# Altium schematic sheet IMU_Motor.SchDoc
size A; SheetNumber: 2; SheetTotal: 3
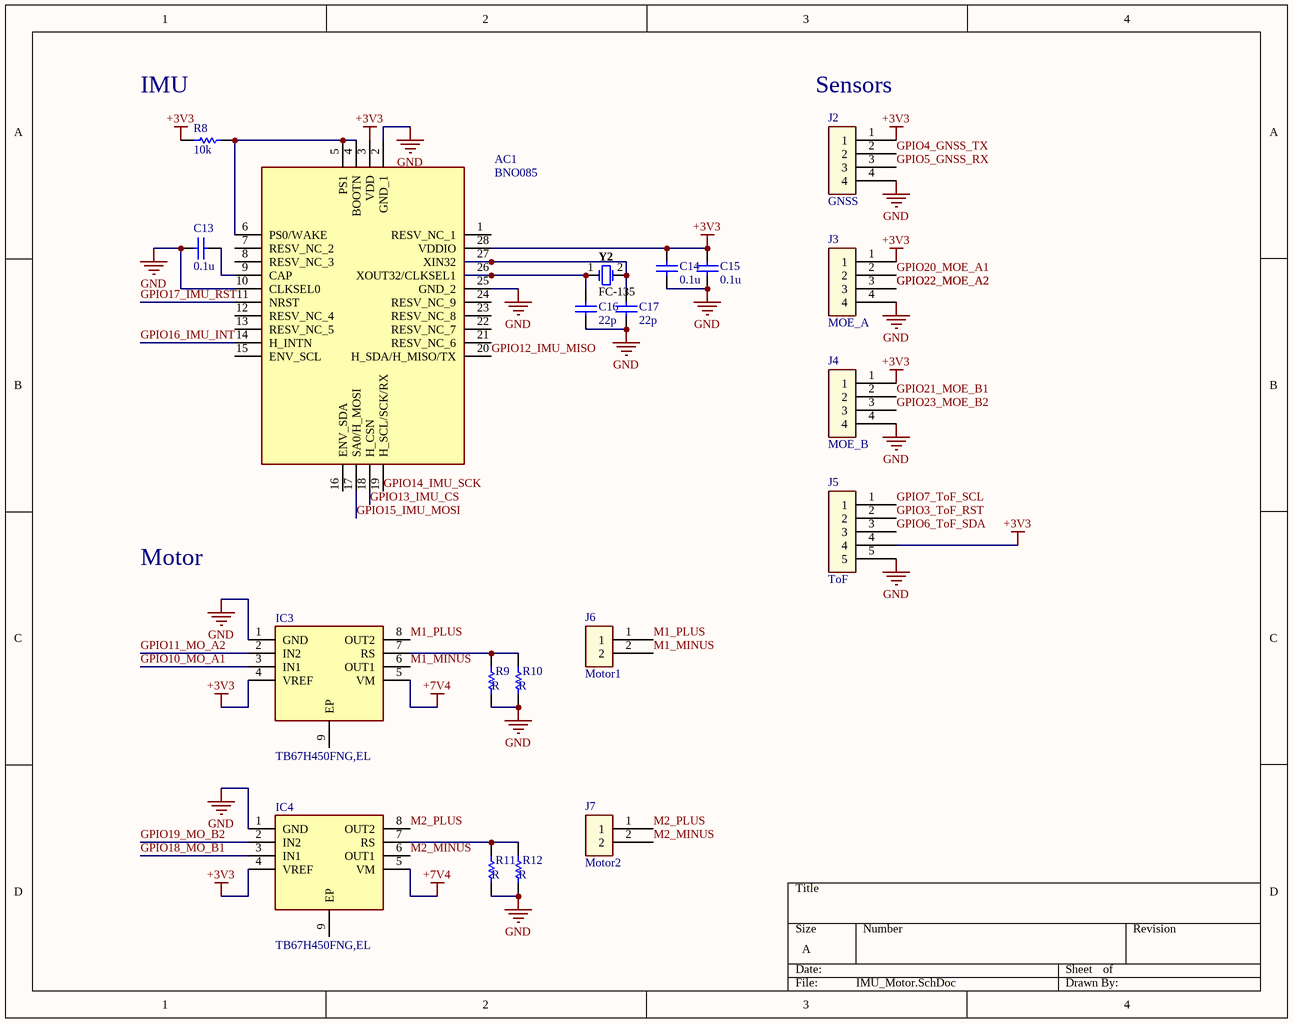
[diagram p0: IMU_Motor.SchDoc]

## Parts
AC1  BNO085  [BNO085]
C13  value 0.1u  [1608[0603]]  (hidden comment: Capacitor)
C14  value 0.1u  [1608[0603]]  (hidden comment: Capacitor)
C15  value 0.1u  [1608[0603]]  (hidden comment: Capacitor)
C16  value 22p  [1608[0603]]  (hidden comment: Capacitor)
C17  value 22p  [1608[0603]]  (hidden comment: Capacitor)
IC3  TB67H450FNG,EL  [SOIC127P600X175-9N]
IC4  TB67H450FNG,EL  [SOIC127P600X175-9N]
J2  GNSS  [PinHeader_2.0_4_SMD]
J3  MOE_A  [PinHeader_2.0_4_SMD]
J4  MOE_B  [PinHeader_2.0_4_SMD]
J5  ToF  [PinHeader_2.0_5_SMD]
J6  Motor1  [PinHeader_2.0_2_SMD]
J7  Motor2  [PinHeader_2.0_2_SMD]
R8  value 10k  [1608[0603]]  (hidden comment: Resistor)
R9  value R  [1608[0603]]  (hidden comment: Resistor)
R10  value R  [1608[0603]]  (hidden comment: Resistor)
R11  value R  [1608[0603]]  (hidden comment: Resistor)
R12  value R  [1608[0603]]  (hidden comment: Resistor)
Y2  FC-135  [EPSON-FC-135_V]

## Nets
+3V3: AC1.3(VDD) AC1.28(VDDIO) C14.2 C15.2 IC3.4(VREF) IC4.4(VREF) J2.1 J3.1 J4.1 J5.4 R8.1
+7V4: IC3.5(VM) IC4.5(VM)
GND: AC1.2(GND_1) AC1.10(CLKSEL0) AC1.25(GND_2) C13.1 C14.1 C15.1 C16.1 C17.1 IC3.1(GND) IC4.1(GND) J2.4 J3.4 J4.4 J5.5 R9.1 R10.1 R11.1 R12.1
GPIO3_ToF_RST: J5.2
GPIO4_GNSS_TX: J2.2
GPIO5_GNSS_RX: J2.3
GPIO6_ToF_SDA: J5.3
GPIO7_ToF_SCL: J5.1
GPIO10_MO_A1: IC3.3(IN1)
GPIO11_MO_A2: IC3.2(IN2)
GPIO12_IMU_MISO: AC1.20(H_SDA/H_MISO/TX)
GPIO13_IMU_CS: AC1.18(H_CSN)
GPIO14_IMU_SCK: AC1.19(H_SCL/SCK/RX)
GPIO15_IMU_MOSI: AC1.17(SA0/H_MOSI)
GPIO16_IMU_INT: AC1.14(H_INTN)
GPIO17_IMU_RST: AC1.11(NRST)
GPIO18_MO_B1: IC4.3(IN1)
GPIO19_MO_B2: IC4.2(IN2)
GPIO20_MOE_A1: J3.2
GPIO21_MOE_B1: J4.2
GPIO22_MOE_A2: J3.3
GPIO23_MOE_B2: J4.3
M1_MINUS: IC3.6(OUT1) J6.2
M1_PLUS: IC3.8(OUT2) J6.1
M2_MINUS: IC4.6(OUT1) J7.2
M2_PLUS: IC4.8(OUT2) J7.1
NetAC1_4: AC1.4(BOOTN) AC1.5(PS1) AC1.6(PS0/WAKE) R8.2
NetAC1_9: AC1.9(CAP) C13.2
NetAC1_26: AC1.26(XOUT32/CLKSEL1) C16.2 Y2.1
NetAC1_27: AC1.27(XIN32) C17.2 Y2.2
NetIC3_7: IC3.7(RS) R9.2 R10.2
NetIC4_7: IC4.7(RS) R11.2 R12.2

Not connected (* = marked no-connect by the designer): AC1 1(RESV_NC_1) 7(RESV_NC_2) 8(RESV_NC_3) 12(RESV_NC_4) 13(RESV_NC_5) 15(ENV_SCL) 16(ENV_SDA) 21(RESV_NC_6) 22(RESV_NC_7) 23(RESV_NC_8) 24(RESV_NC_9); IC3 9(EP); IC4 9(EP)

## Notes on the sheet
- (near R8) IMU
- (near J2) Sensors
- Motor

## Library data of the parts
AC1 = BNO085: Accelerometer; Manufacturer_Name: Hillcrest Laboratories; Datasheet Link: https://www.hillcrestlabs.com/downloads/bno080-datasheet; Height: 1.18mm; Manufacturer_Part_Number: BNO085
C13-C17 = Capacitor: SimulationGenericComponent: True
IC3 IC4 = TB67H450FNG,EL: Integrated Circuit; Manufacturer_Name: Toshiba; Datasheet Link: http://toshiba.semicon-storage.com/info/docget.jsp?did=65346&prodName=TB67H450FNG; Height: 1.75mm; Manufacturer_Part_Number: TB67H450FNG,EL; Mouser Part Number: 757-TB67H450FNGEL; Mouser Price/Stock: https://www.mouser.co.uk/ProductDetail/Toshiba/TB67H450FNGEL?qs=h6V4JsTaLXeReNg2bp0jug%3D%3D; Arrow Part Number: TB67H450FNG,EL; Arrow Price/Stock: https://www.arrow.com/en/products/tb67h450fngel/toshiba?region=nac
J2-J4 = PinHeader_2.0_4_SMD
J5 = PinHeader_2.0_5_SMD
J6 J7 = PinHeader_2.0_2_SMD
R8-R12 = Resistor: TC1: 0; SimulationGenericComponent: True; TC2: 0
Y2 = CMP-2100-03637-1: Crystal Unit, 32 to 77.5 KHz, 0.5 uW, -40 to 85 degC, 2-Pin SMD, RoHS; Manufacturer: Epson; RoHSCompliant: false; Datasheet URL: http://www5.epsondevice.com/en/products/khz_range/fc135r.html#; Datasheet Version: 42036.0; Manufacturer URL: https://www.eea.epson.com/; Package Reference: FC-135; Package Description: 2-Pin Surface Mount Device, Body 3.2 x 1.5 mm